# Altium schematic sheet 23.SchDoc
size 297 x 209 mm
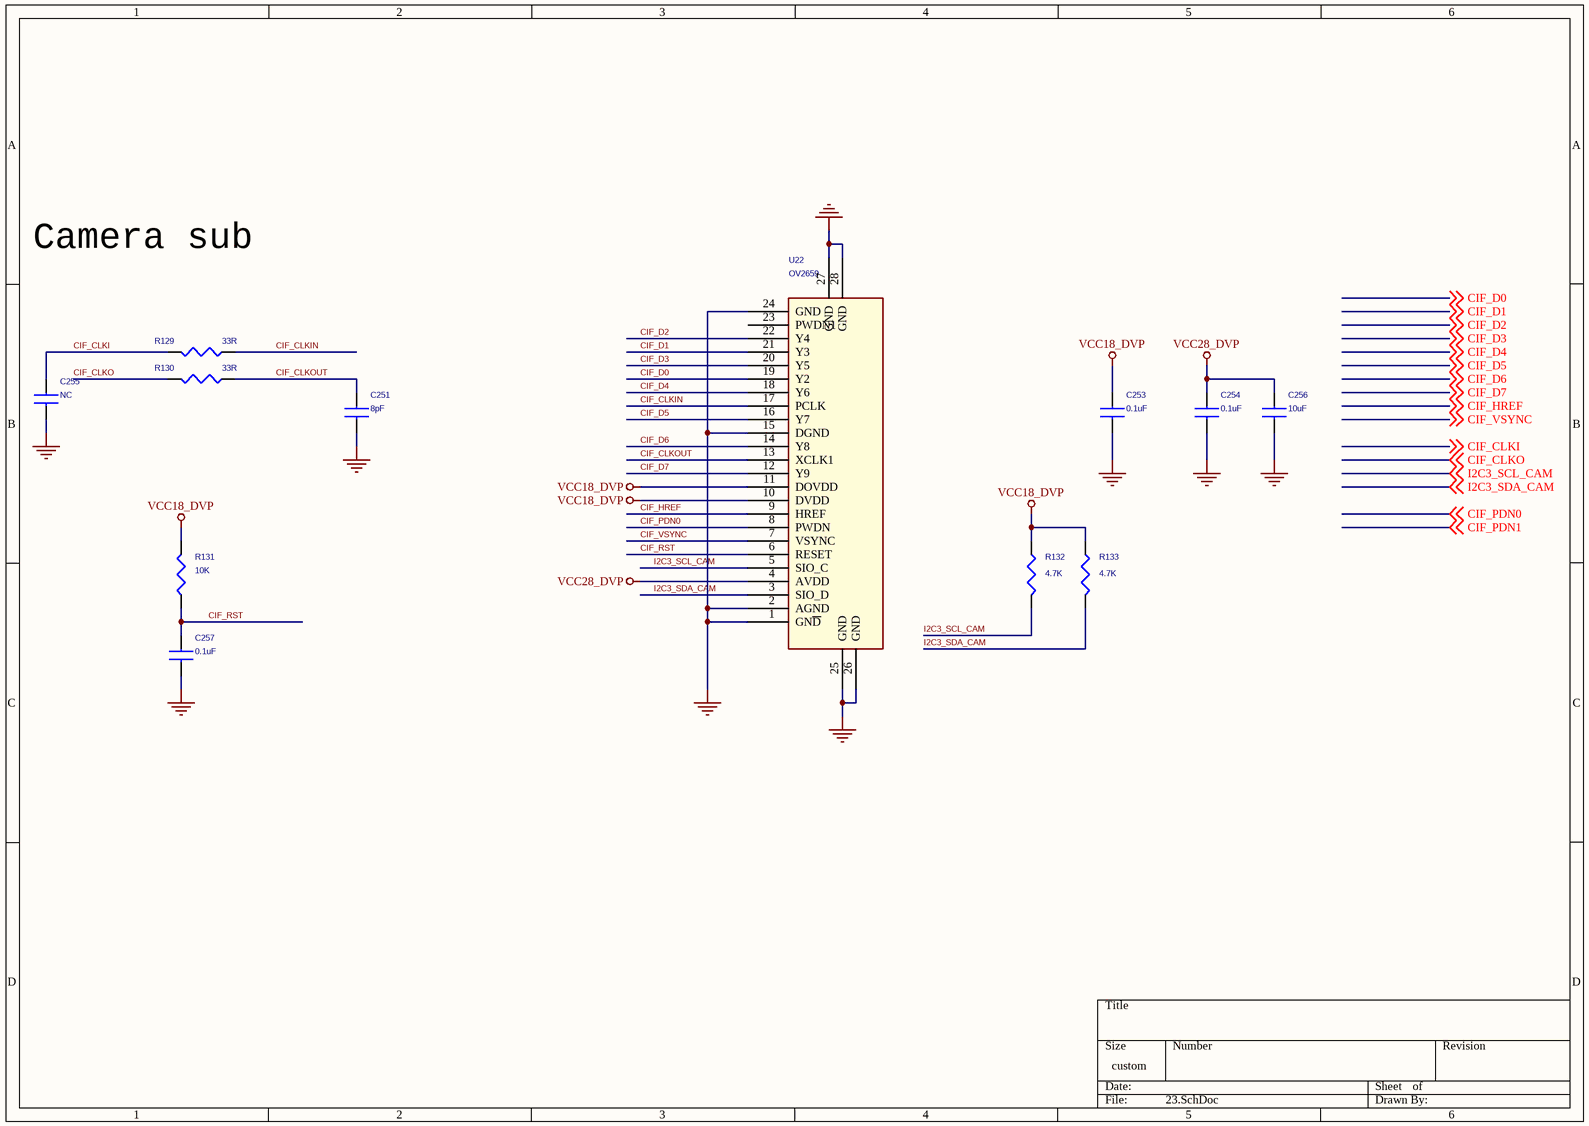
[diagram p0: 23.SchDoc]

## Parts
C251  8pF  [C0603]
C253  0.1uF  [C0603]
C254  0.1uF  [C0603]
C255  NC  [C0603]
C256  10uF  [C0603]
C257  0.1uF  [C0603]
R129  33R  [r0402]
R130  33R  [r0402]
R131  10K  [r0402]
R132  4.7K  [r0402]
R133  4.7K  [r0402]
U22  OV2659  [AXT524124]

## Nets
GND: C251.1 C253.1 C254.1 C255.1 C256.1 C257.1 U22.1(GN~{D}) U22.2(AGND) U22.15(DGND) U22.24(GND) U22.25(GND) U22.26(GND) U22.27(GND) U22.28(GND)
VCC18_DVP: C253.2 R131.2 R132.1 R133.1 U22.10(DVDD) U22.11(DOVDD)
VCC28_DVP: C254.2 C256.2 U22.4(AVDD)
CIF_CLKI: C255.2 R129.2 ; off-sheet CIF_CLKI
CIF_CLKIN: R129.1 U22.17(PCLK)
CIF_CLKO: R130.2 ; off-sheet CIF_CLKO
CIF_CLKOUT: C251.2 R130.1 U22.13(XCLK1)
CIF_D0: U22.19(Y2) ; off-sheet CIF_D0
CIF_D1: U22.21(Y3) ; off-sheet CIF_D1
CIF_D2: U22.22(Y4) ; off-sheet CIF_D2
CIF_D3: U22.20(Y5) ; off-sheet CIF_D3
CIF_D4: U22.18(Y6) ; off-sheet CIF_D4
CIF_D5: U22.16(Y7) ; off-sheet CIF_D5
CIF_D6: U22.14(Y8) ; off-sheet CIF_D6
CIF_D7: U22.12(Y9) ; off-sheet CIF_D7
CIF_HREF: U22.9(HREF) ; off-sheet CIF_HREF
CIF_PDN0: U22.8(PWDN) ; off-sheet CIF_PDN0
CIF_RST: C257.2 R131.1 U22.6(RESET)
CIF_VSYNC: U22.7(VSYNC) ; off-sheet CIF_VSYNC
I2C3_SCL_CAM: R132.2 U22.5(SIO_C) ; off-sheet I2C3_SCL_CAM
I2C3_SDA_CAM: R133.2 U22.3(SIO_D) ; off-sheet I2C3_SDA_CAM

Not connected (* = marked no-connect by the designer): U22 23(PWDN1)

## Notes on the sheet
- Camera sub

## Library data of the parts
C251 C255 = CAP NP_Dup3: CAP,MLCC,8pF,+/-10%,NPO,6.3V,SMD0402
C253 C254 C256 = CAP NP_Dup3: ROOM: CHG
C257 = CAP NP_Dup3: CAP,MLCC,100nF,+/-10%,X7R,6.3V,SMD0402
R129 R130 = RESISTOR_0_Dup1: RES,thick film,22Ohm,+/-5%,1/16W,SMD0402
R131 = RESISTOR: NC
R132 R133 = RESISTOR_0_Dup3
U22 = LCM0200CE1A0_0